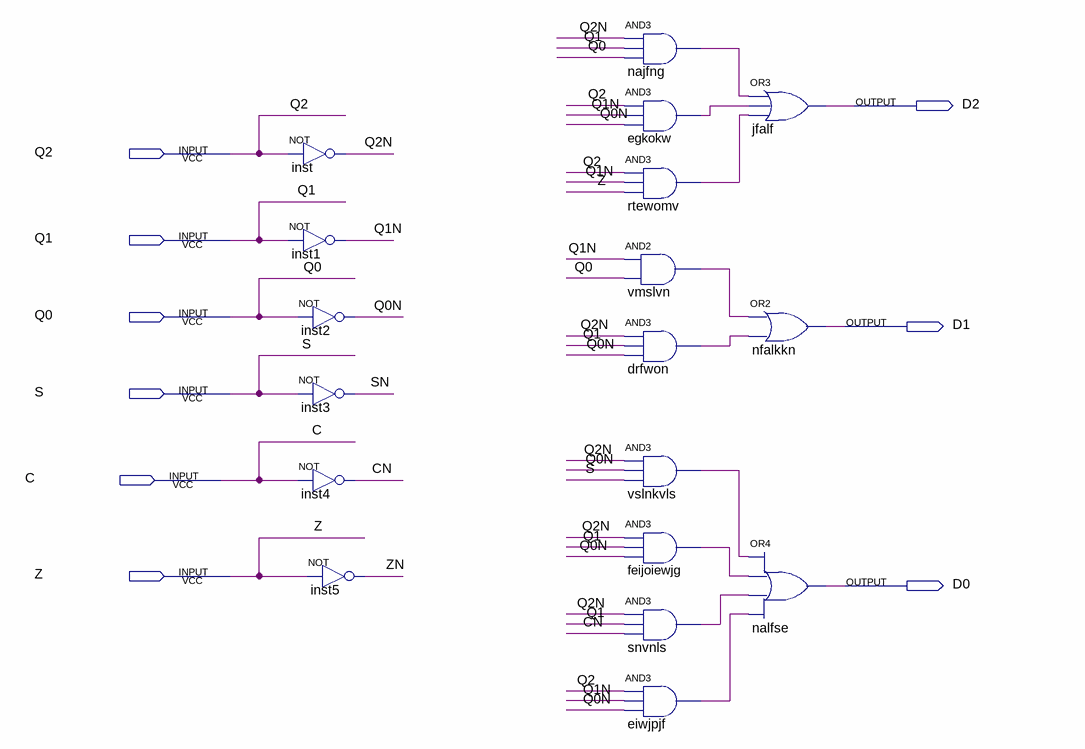
[diagram p0: schematic sheet]
// Quartus schematic next_state.bdf as structural Verilog: 18 symbols, 9 pins
module next_state (
  input  Q2,
  input  Q1,
  input  Q0,
  input  S,
  input  C,
  input  Z,
  output D2,
  output D1,
  output D0
);

  wire CN, drfwon_out, egkokw_out, eiwjpjf_out, feijoiewjg_out, najfng_out, Q0N, Q1N, Q2N, rtewomv_out, SN,
       snvnls_out, vmslvn_out, vslnkvls_out, ZN;

  not inst (Q2N, Q2);
  not inst1 (Q1N, Q1);
  not inst2 (Q0N, Q0);
  not inst3 (SN, S);
  not inst4 (CN, C);
  not inst5 (ZN, Z);
  and najfng (najfng_out, Q2N, Q1, Q0);
  and egkokw (egkokw_out, Q2, Q1N, Q0N);
  and rtewomv (rtewomv_out, Q2, Q1N, Z);
  and vmslvn (vmslvn_out, Q1N, Q0);
  and drfwon (drfwon_out, Q2N, Q1, Q0N);
  and vslnkvls (vslnkvls_out, Q2N, Q0N, S);
  and feijoiewjg (feijoiewjg_out, Q2N, Q1, Q0N);
  and snvnls (snvnls_out, Q2N, Q1, CN);
  and eiwjpjf (eiwjpjf_out, Q2, Q1N, Q0N);
  or jfalf (D2, najfng_out, egkokw_out, rtewomv_out);
  or nfalkkn (D1, vmslvn_out, drfwon_out);
  or nalfse (D0, vslnkvls_out, feijoiewjg_out, snvnls_out, eiwjpjf_out);
endmodule
